# EAGLE design pcb_final (EAGLE 9.3.0)
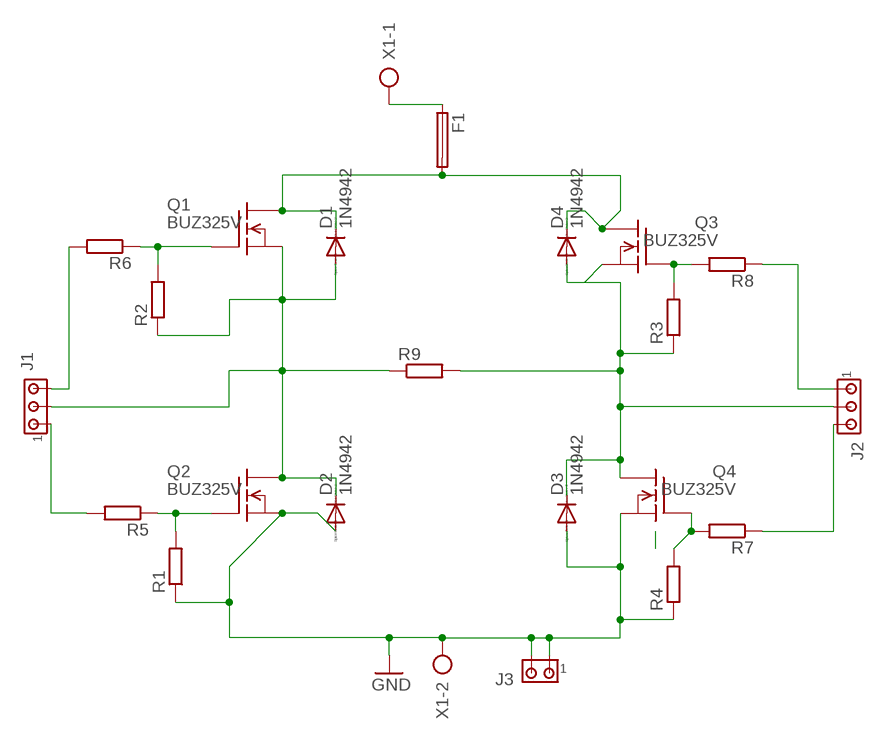
[diagram p0: schematic, sheet 1]

## Parts
D1  1N4942  [DO41-10]
D2  1N4942  [DO41-10]
D3  1N4942  [DO41-10]
D4  1N4942  [DO41-10]
F1  19560  [19560]
J1  MTA03-100  [10X03MTA]
J2  MTA03-100  [10X03MTA]
J3  MTA02-100  [10X02MTA]
Q1  BUZ325V  [TO218V]
Q2  BUZ325V  [TO218V]
Q3  BUZ325V  [TO218V]
Q4  BUZ325V  [TO218V]
R1  R-EU_0207/10  [0207/10]
R2  R-EU_0207/10  [0207/10]
R3  R-EU_0207/10  [0207/10]
R4  R-EU_0207/10  [0207/10]
R5  R-EU_0207/10  [0207/10]
R6  R-EU_0207/10  [0207/10]
R7  R-EU_0207/10  [0207/10]
R8  R-EU_0207/10  [0207/10]
R9  R-EU_0207/10  [0207/10]
X1  AK300/2  [AK300/2]

## Nets
GND: D2.A D3.A J3.1 J3.2 Q2.3(S) Q4.3(S) R1.1 R4.1 X1.2
N$1: J1.3 R6.2
N$2: Q1.1(G) R2.2 R6.1
N$3: J1.1 R5.2
N$4: J2.3 R7.1
N$5: Q2.1(G) R1.2 R5.1
N$6: D1.C D4.C F1.2 Q1.2(D) Q3.2(D)
N$7: Q4.1(G) R4.2 R7.2
N$8: D1.A D2.C J1.2 Q1.3(S) Q2.2(D) R2.1 R9.1
N$10: Q3.1(G) R3.2 R8.2
N$12: F1.1 X1.1
N$16: J2.1 R8.1
N$22: D3.C D4.A J2.2 Q3.3(S) Q4.2(D) R3.1 R9.2

## Library data of the parts
D1-D4 = diode:1N4942: DIODE 1.0 A, 200 V, 150 ns
F1 = fuse:19560: FUSE HOLDER TR5, Wickmann; MPN: 56000001009; OC_FARNELL: 1185363; OC_NEWARK: 15P8392
J1 J2 = con-amp:MTA03-100: AMP connector
J3 = con-amp:MTA02-100: AMP connector
Q1-Q4 = transistor-fet:BUZ325: N-Channel Enhancement MOSFET 400V; 10,5A; 0,5Ohm
R1-R9 = rcl:R-EU_: RESISTOR, European symbol
X1 = con-ptr500:AK300/2: CONNECTOR; OC_FARNELL: unknown; OC_NEWARK: unknown

## Board
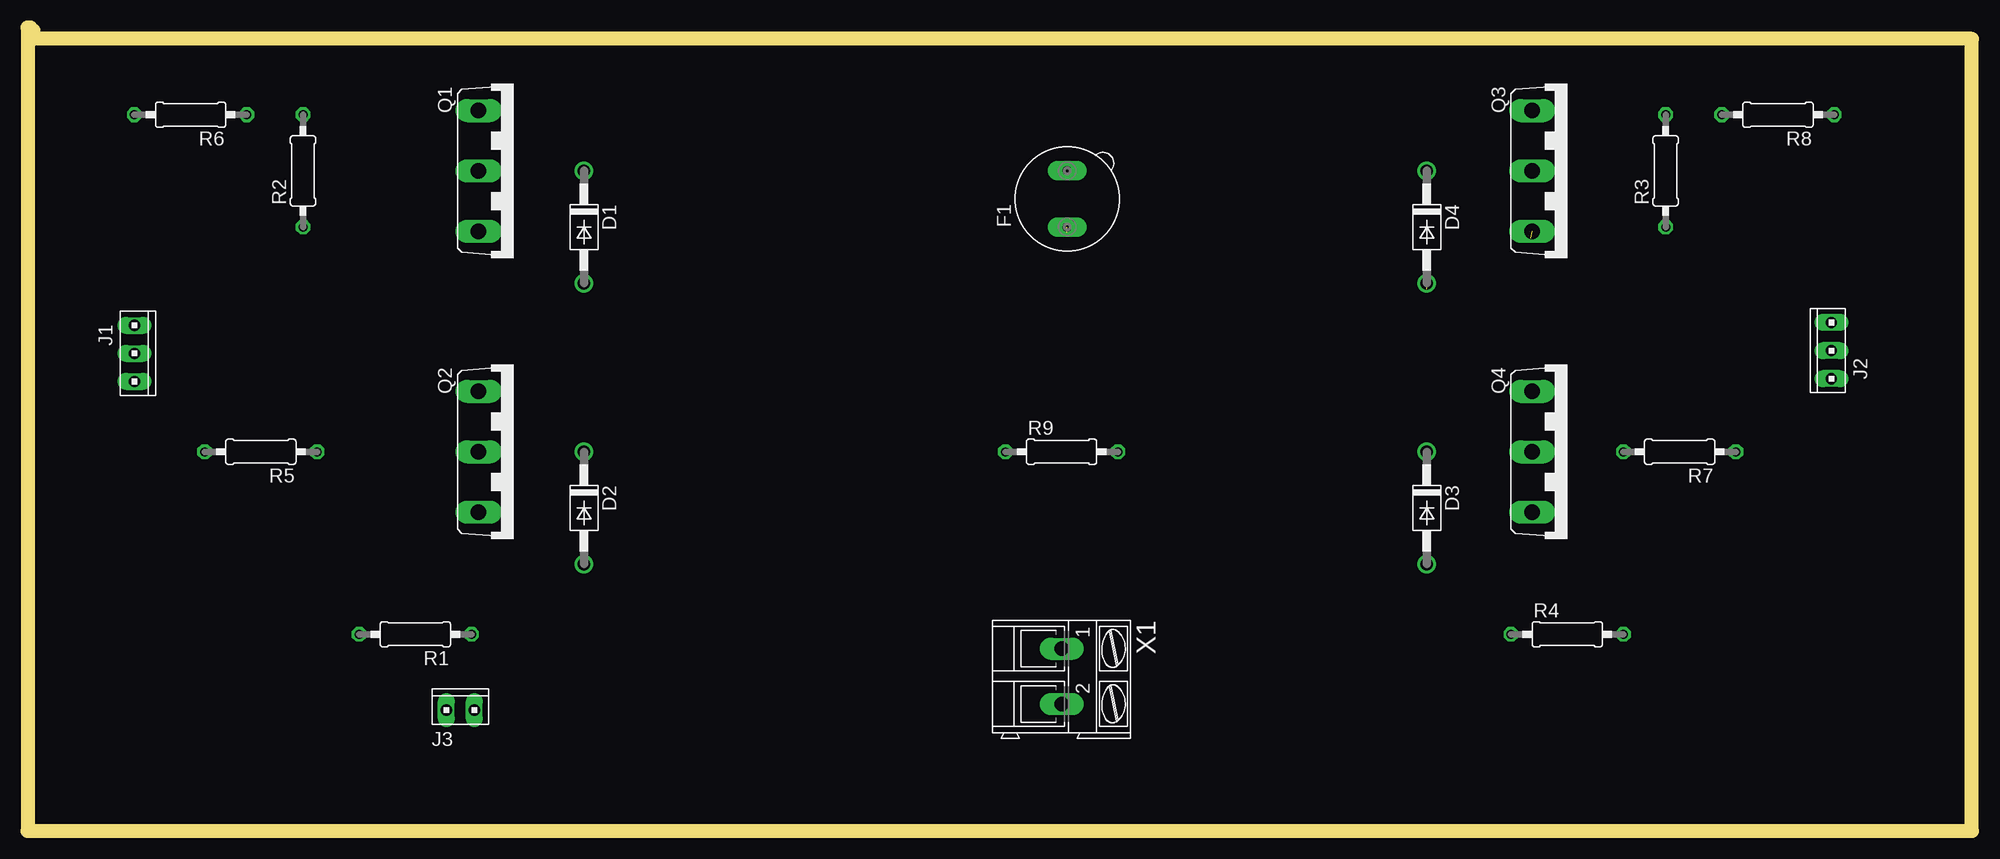
[diagram p1: board, top side]
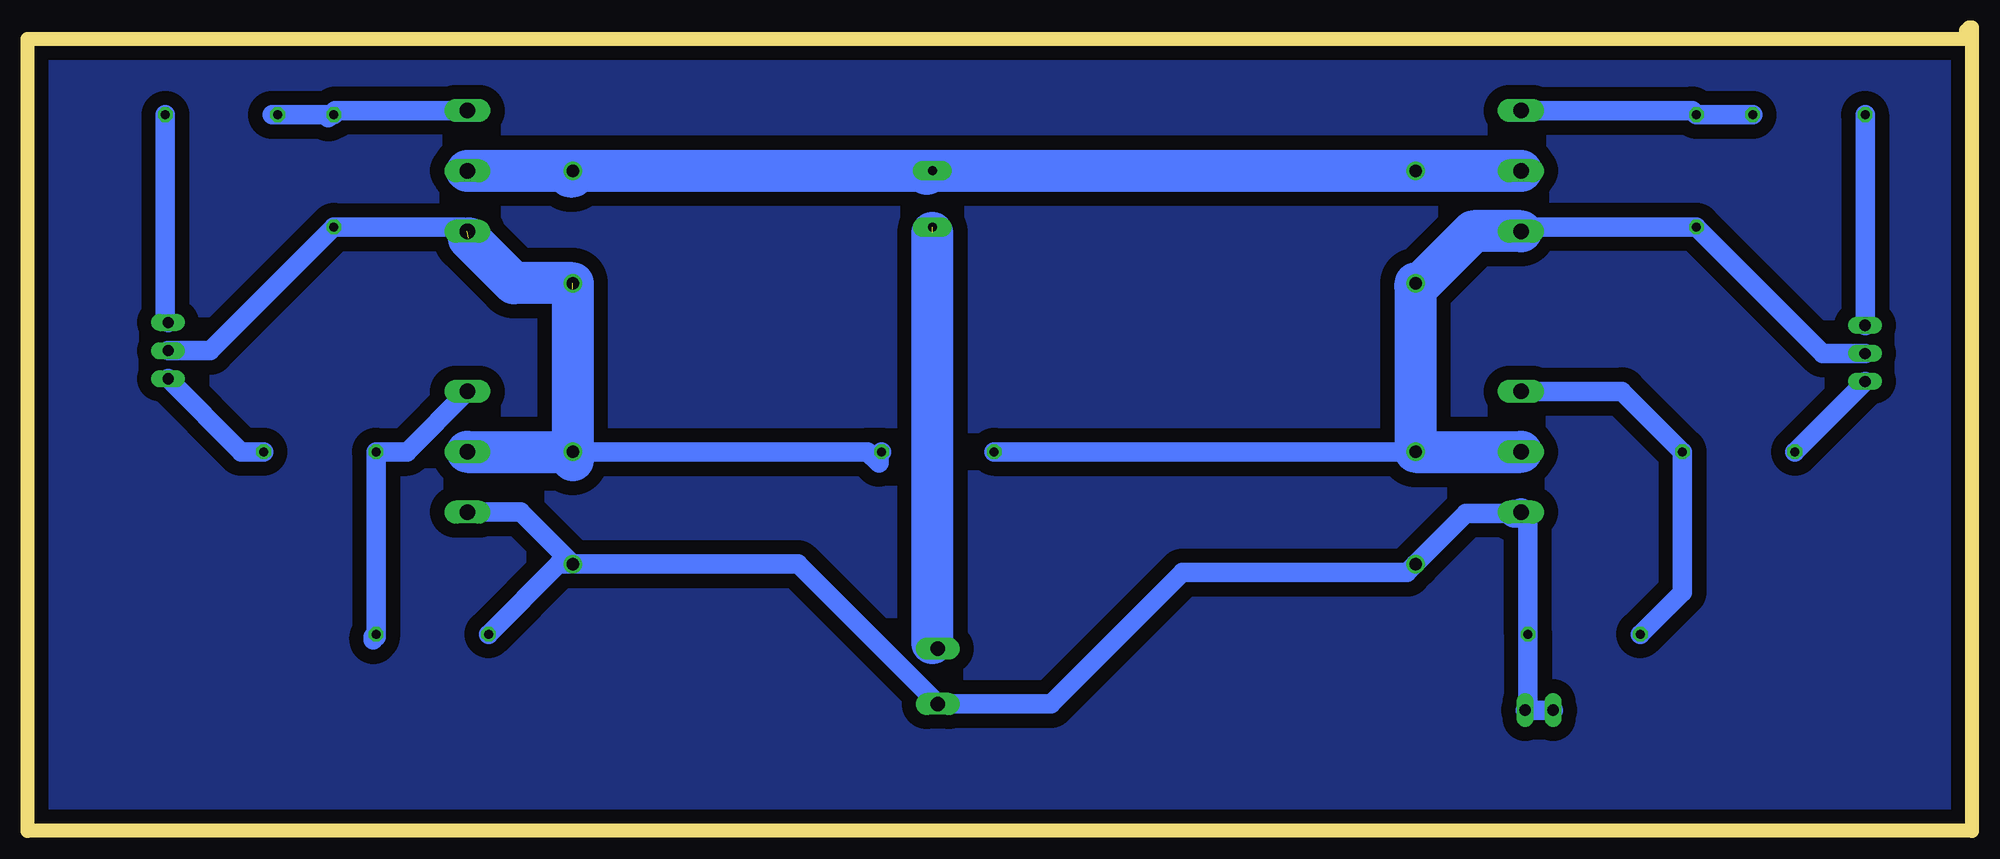
[diagram p2: board, bottom side, seen from below]

Size 175.77 x 72.64 mm. Coordinates in mm from the lower left corner, seen from the top.
Outline: 0.25,72.64 0,72.64 0,0 175.77,0 175.77,71.63 0.51,71.63 0.51,72.39
Copper layers (1*16): Top 0.035mm / dielectric 1.5mm / Bottom 0.035mm
Design rules "default": minimum track width 10mil, minimum drill 24mil, track to track 8mil, track to pad 8mil, pad to pad 8mil, via to via 8mil, smd to smd 8mil, copper to edge 40mil, drill to drill 8mil, minimum pad ring 10mil, minimum via ring 8mil, stop-mask expansion 4mil, vias tented up to drill 0mil, thermal gap 10mil

### Footprints (pad centres in the part's own frame; a part is rotated, then mirrored left to right if it is on the bottom)
DO41-10 = drill 1.118: A 5.08,0; C -5.08,0
19560 = drill 0.813 pad 1.778 long: 1 -2.54,0; 2 2.54,0
10X03MTA = drill 1.016 long: 1 2.54,0; 2 0,0; 3 -2.54,0
10X02MTA = drill 1.016 long: 1 1.27,0; 2 -1.27,0
TO218V = drill 1.397 long: 1 -5.461,-3.175; 2 0,-3.175; 3 5.461,-3.175
0207/10 = drill 0.813 octagon: 1 -5.08,0; 2 5.08,0
AK300/2 = drill 1.321 long: 1 -2.515,0; 2 2.489,0

### Placement (x,y rotation side)
D1  50.29,54.61 270 top
D2  50.29,29.21 270 top
D3  126.49,29.21 270 top
D4  126.49,54.61 270 top
F1  93.98,57.15 90 top
J1  9.65,43.18 270 top
J2  163.07,43.43 90 top
J3  39.12,10.92 0 top
Q1  43.94,59.69 270 top
Q2  43.94,34.29 270 top
Q3  139.19,59.69 270 top
Q4  139.19,34.29 270 top
R1  35.05,17.78 180 top
R2  24.89,59.69 90 top
R3  148.08,59.69 90 top
R4  139.19,17.78 0 top
R5  21.08,34.29 180 top
R6  14.73,64.77 180 top
R7  149.35,34.29 180 top
R8  158.24,64.77 180 top
R9  93.47,34.29 0 top
X1  93.47,13.97 270 top

### Tracks (layer width: path | path; a pad name or v marks a point on that pad's centre or on a via)
GND
  Bottom 1.778: Q4.3 131.19,28.83 D3.A | D3.A 127.76,24.13 R4.1 | D3.A 106.12,24.13 X1.2 83.26,11.48 71.37,23.37 51.05,23.37 D2.A 45.72,28.7 41.4,28.7 | Q2.3 40.13,28.19 R1.1 40.13,11.18 J3.1 J3.2
  Bottom 2.54: 41.4,28.7 40.89,28.7 Q2.3
N$1
  Bottom 1.778: R6.2 J1.3
N$2
  Bottom 1.778: Q1.1 25.27,65.15 R2.2 R6.1
N$3
  Bottom 1.778: R5.2 J1.1
N$4
  Bottom 1.778: R7.1 156.46,34.29 J2.3
N$5
  Bottom 1.778: Q2.1 31.62,39.75 R5.1 26.16,21.59 R1.2
N$6
  Bottom 1.778: 94.74,59.69 94.49,59.44 94.23,59.69 | 41.4,59.69 40.89,60.2 40.89,59.82 Q1.2
  Bottom 2.54: 136.65,59.44 136.02,59.44 Q3.2 | 94.23,59.69 F1.2
  Bottom 3.81: Q3.2 126.75,59.69 126.75,59.18 126.49,59.18 D4.C 94.49,59.69 94.49,59.44 | F1.2 D1.C Q1.2
N$7
  Bottom 1.778: Q4.1 141.48,34.29 R7.2 R4.2 | R4.2 144.27,17.53 144.53,17.27 144.53,17.53 R4.2
N$8
  Bottom 1.778: R9.1 D2.C | J1.2 13.46,43.18 R2.1 40.39,54.61 Q1.3
  Bottom 3.81: Q1.3 45.09,54.23 50.29,49.02 D1.A D2.C Q2.2
N$9
  pour Bottom (isolate 1.27): -0.25,72.64 0.25,0.51 125.22,1.78 153.92,1.78 175.01,1.52 174.75,71.63
N$10
  Bottom 1.778: Q3.1 147.96,65.15 148.34,64.77 | 148.34,64.77 148.59,64.52 148.84,64.77 R8.2 153.67,64.77 | R3.2 148.34,64.77
N$12  (1 unrouted)
  Bottom 1.778: 93.98,16.99 X1.1
  Bottom 3.81: 93.98,16.99 93.98,54.1
N$16
  Bottom 1.778: R8.1 163.32,46.23 J2.1
N$22  (2 unrouted)
  Bottom 1.778: J2.2 159.26,43.43 R3.1 136.4,54.61 Q3.3 | 135.76,34.54 136.4,34.54 136.14,34.29 Q4.2 135.76,34.54 | 135.64,34.54 135.76,34.54 | D3.C 99.82,34.29 98.81,33.27 98.81,34.04 R9.2
  Bottom 3.81: D4.A 131.83,49.53 135.89,53.59 | 126.49,49.02 D3.C | D3.C 126.49,33.53 126.75,33.78 126.75,34.04 D3.C | Q4.2 D3.C